# EAGLE schematic LinearPSURevDV4 (EAGLE 8.2.2)
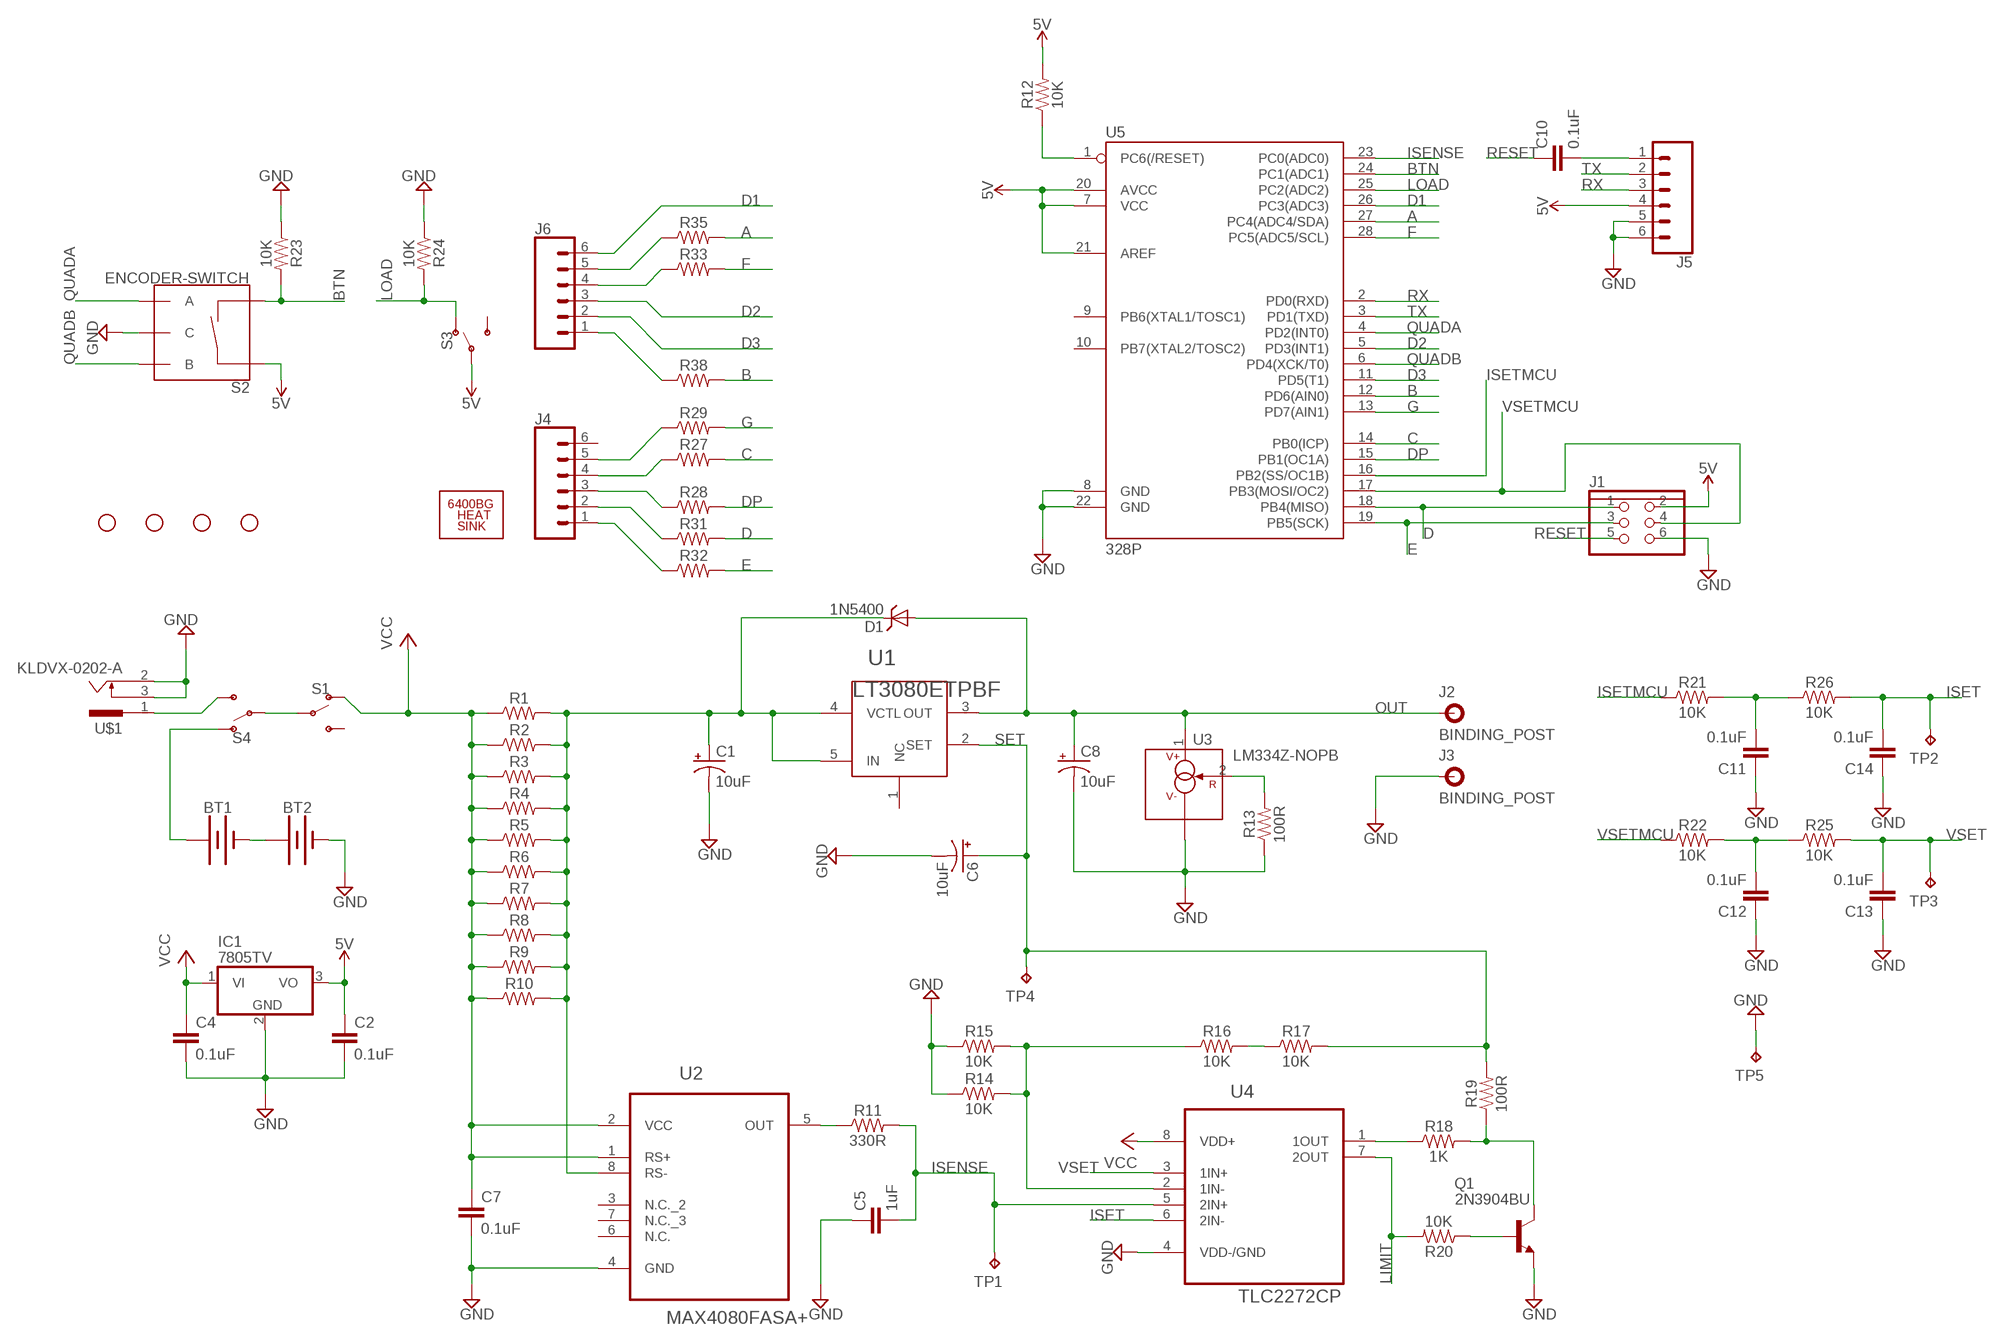
[diagram p0: schematic, sheet 1]

## Parts
BT1  BATTERY-9V  [BATTCON_9V]
BT2  BATTERY-9V  [BATTCON_9V]
C1  10uF  10UF-POLAR-RADIAL-2.5MM-25V-20%  [CPOL-RADIAL-2.5MM-5MM]
C2  0.1uF  22PF-PTH-2.54MM-200V-5%  [CAP-PTH-2.54]
C4  0.1uF  22PF-PTH-2.54MM-200V-5%  [CAP-PTH-2.54]
C5  1uF  22PF-PTH-2.54MM-200V-5%  [CAP-PTH-2.54]
C6  10uF  10UF-POLAR-RADIAL-2.5MM-25V-20%  [CPOL-RADIAL-2.5MM-5MM]
C7  0.1uF  22PF-PTH-2.54MM-200V-5%  [CAP-PTH-2.54]
C8  10uF  10UF-POLAR-RADIAL-2.5MM-25V-20%  [CPOL-RADIAL-2.5MM-5MM]
C10  0.1uF  22PF-PTH-2.54MM-200V-5%  [CAP-PTH-2.54]
C11  0.1uF  22PF-PTH-2.54MM-200V-5%  [CAP-PTH-2.54]
C12  0.1uF  22PF-PTH-2.54MM-200V-5%  [CAP-PTH-2.54]
C13  0.1uF  22PF-PTH-2.54MM-200V-5%  [CAP-PTH-2.54]
C14  0.1uF  22PF-PTH-2.54MM-200V-5%  [CAP-PTH-2.54]
D1  1N5400  [DO201-15]
H1  STAND-OFF  [STAND-OFF]
H2  STAND-OFF  [STAND-OFF]
H3  STAND-OFF  [STAND-OFF]
H4  STAND-OFF  [STAND-OFF]
H5  6400BG_HEATSINK  [6400BG_HEATSINK]
IC1  7805TV  [TO220V]
J1  PINHD2X03  [PINHD2X03]
J2  BINDING_POST  [BINDING_POST]
J3  BINDING_POST  [BINDING_POST]
J4  CONN_06NO_SILK_FEMALE_PTH  [1X06_NO_SILK]
J5  CONN_06NO_SILK_FEMALE_PTH  [1X06_NO_SILK]
J6  CONN_06NO_SILK_FEMALE_PTH  [1X06_NO_SILK]
Q1  2N3904BU  [TO92]
R1  2R  0OHM-0603-1/10W-5%  [0603]
R2  2R  0OHM-0603-1/10W-5%  [0603]
R3  2R  0OHM-0603-1/10W-5%  [0603]
R4  2R  0OHM-0603-1/10W-5%  [0603]
R5  2R  0OHM-0603-1/10W-5%  [0603]
R6  2R  0OHM-0603-1/10W-5%  [0603]
R7  2R  0OHM-0603-1/10W-5%  [0603]
R8  2R  0OHM-0603-1/10W-5%  [0603]
R9  2R  0OHM-0603-1/10W-5%  [0603]
R10  2R  0OHM-0603-1/10W-5%  [0603]
R11  330R  1KOHM-HORIZ-1/4W-1%  [AXIAL-0.3]
R12  10K  1KOHM-HORIZ-1/4W-1%  [AXIAL-0.3]
R13  100R  1KOHM-HORIZ-1/4W-1%  [AXIAL-0.3]
R14  10K  1KOHM-HORIZ-1/4W-1%  [AXIAL-0.3]
R15  10K  1KOHM-HORIZ-1/4W-1%  [AXIAL-0.3]
R16  10K  1KOHM-HORIZ-1/4W-1%  [AXIAL-0.3]
R17  10K  1KOHM-HORIZ-1/4W-1%  [AXIAL-0.3]
R18  1K  1KOHM-HORIZ-1/4W-1%  [AXIAL-0.3]
R19  100R  1KOHM-HORIZ-1/4W-1%  [AXIAL-0.3]
R20  10K  1KOHM-HORIZ-1/4W-1%  [AXIAL-0.3]
R21  10K  1KOHM-HORIZ-1/4W-1%  [AXIAL-0.3]
R22  10K  1KOHM-HORIZ-1/4W-1%  [AXIAL-0.3]
R23  10K  1KOHM-HORIZ-1/4W-1%  [AXIAL-0.3]
R24  10K  1KOHM-HORIZ-1/4W-1%  [AXIAL-0.3]
R25  10K  1KOHM-HORIZ-1/4W-1%  [AXIAL-0.3]
R26  10K  1KOHM-HORIZ-1/4W-1%  [AXIAL-0.3]
R27  10K  1KOHM-HORIZ-1/4W-1%  [AXIAL-0.3]
R28  10K  1KOHM-HORIZ-1/4W-1%  [AXIAL-0.3]
R29  10K  1KOHM-HORIZ-1/4W-1%  [AXIAL-0.3]
R31  10K  1KOHM-HORIZ-1/4W-1%  [AXIAL-0.3]
R32  10K  1KOHM-HORIZ-1/4W-1%  [AXIAL-0.3]
R33  10K  1KOHM-HORIZ-1/4W-1%  [AXIAL-0.3]
R35  10K  1KOHM-HORIZ-1/4W-1%  [AXIAL-0.3]
R38  10K  1KOHM-HORIZ-1/4W-1%  [AXIAL-0.3]
S1  SWITCH-SPDT-PTH-11.6X4.0MM-LOCK  [SWITCH_SPDT_PTH_11.6X4.0MM_LOCK]
S2  ENCODER-SWITCH  [ROTARY_ENC_PLAIN]
S3  SWITCH-SPDT-PTH-11.6X4.0MM-LOCK  [SWITCH_SPDT_PTH_11.6X4.0MM_LOCK]
S4  SWITCH-SPDT-PTH-11.6X4.0MM-LOCK  [SWITCH_SPDT_PTH_11.6X4.0MM_LOCK]
TP1  TPTP14SQ  [TP14SQ]
TP2  TPTP14SQ  [TP14SQ]
TP3  TPTP14SQ  [TP14SQ]
TP4  TPTP14SQ  [TP14SQ]
TP5  TPTP14SQ  [TP14SQ]
U1  LT3080ETPBF  [TO220-51]
U2  MAX4080FASA+  [SOIC127P600X175-8N]
U3  LM334Z-NOPB  [TO92]
U4  TLC2272CP  [DIP254P762X508-8]
U5  328P  ATMEGA328P_PDIP  [DIP28]
U$1  KLDVX-0202-A  [KLDVX-0202-A]

## Nets
5V: C2.1 IC1.3(VO) J1.2 J5.4 R12.P$2 S2.SW+ S3.2(P) U5.7(VCC) U5.20(AVCC) U5.21(AREF)
A: R35.P$2 U5.27(PC4(ADC4/SDA))
B: R38.P$2 U5.12(PD6(AIN0))
BTN: R23.P$2 S2.SW- U5.24(PC1(ADC1))
C: R27.P$2 U5.14(PB0(ICP))
D: J1.1 R31.P$2 U5.18(PB4(MISO))
D1: J6.6 U5.26(PC3(ADC3))
D2: J6.3 U5.5(PD3(INT1))
D3: J6.2 U5.11(PD5(T1))
DP: R28.P$2 U5.15(PB1(OC1A))
E: J1.3 R32.P$2 U5.19(PB5(SCK))
F: R33.P$2 U5.28(PC5(ADC5/SCL))
G: R29.P$2 U5.13(PD7(AIN1))
GND: BT2.- C1.2(-) C2.2 C4.2 C5.1 C6.2(-) C7.2 C8.2(-) C11.1 C12.1 C13.1 C14.1 IC1.2(GND) J1.6 J3.P$1 J5.5 J5.6 Q1.3(E) R13.P$1 R14.P$1 R15.P$1 R23.P$1 R24.P$1 S2.C TP5.TP U2.4(GND) U3.3(V-) U4.4(VDD-/GND) U5.8(GND) U5.22(GND) U$1.2 U$1.3
ISENSE: C5.2 R11.P$2 TP1.TP U4.5(2IN+) U5.23(PC0(ADC0))
ISET: C14.2 R26.P$2 TP2.TP U4.6(2IN-)
ISETMCU: R21.P$1 U5.16(PB2(SS/OC1B))
LIMIT: R20.P$2 U4.7(2OUT)
LOAD: R24.P$2 S3.1(O) U5.25(PC2(ADC2))
N$1: S4.3(S) U$1.1
N$2: C10.2 J5.1
N$4: C1.1(+) D1.C R1.2 R2.2 R3.2 R4.2 R5.2 R6.2 R7.2 R8.2 R9.2 R10.2 U1.4(VCTL) U1.5(IN) U2.8(RS-)
N$5: R11.P$1 U2.5(OUT)
N$6: R18.P$1 U4.1(1OUT)
N$7: R13.P$2 U3.2(R)
N$8: Q1.1(C) R18.P$2 R19.P$1
N$9: Q1.2(B) R20.P$1
N$10: R16.P$2 R17.P$1
N$11: R14.P$2 R15.P$2 R16.P$1 U4.2(1IN-)
N$13: BT1.- BT2.+
N$14: S1.2(P) S4.2(P)
N$15: BT1.+ S4.1(O)
N$17: J4.5 R29.P$1
N$18: J4.4 R27.P$1
N$19: J4.3 R28.P$1
N$20: C11.2 R21.P$2 R26.P$1
N$21: C12.2 R22.P$2 R25.P$1
N$22: J4.2 R31.P$1
N$23: J4.1 R32.P$1
N$31: J6.5 R35.P$1
N$32: J6.4 R33.P$1
N$35: J6.1 R38.P$1
OUT: C8.1(+) D1.A J2.P$1 U1.3(OUT) U3.1(V+)
QUADA: S2.A U5.4(PD2(INT0))
QUADB: S2.B U5.6(PD4(XCK/T0))
RESET: C10.1 J1.5 R12.P$1 U5.1(PC6(/RESET))
RX: J5.3 U5.2(PD0(RXD))
SET: C6.1(+) R17.P$2 R19.P$2 TP4.TP U1.2(SET)
TX: J5.2 U5.3(PD1(TXD))
VCC: C4.1 C7.1 IC1.1(VI) R1.1 R2.1 R3.1 R4.1 R5.1 R6.1 R7.1 R8.1 R9.1 R10.1 S1.1(O) U2.1(RS+) U2.2(VCC) U4.8(VDD+)
VSET: C13.2 R25.P$2 TP3.TP U4.3(1IN+)
VSETMCU: J1.4 R22.P$1 U5.17(PB3(MOSI/OC2))
Unconnected: J4.6 S1.3(S) S3.3(S) U1.1(NC) U2.3(N.C._2) U2.6(N.C.) U2.7(N.C._3) U5.9(PB6(XTAL1/TOSC1)) U5.10(PB7(XTAL2/TOSC2)) U$1.1@1 U$1.2@1 U$1.3@1

## Library data of the parts
BT1 BT2 = SparkFun-Batteries:BATTERY: Battery - Single Cell A variety of battery chemistries, sizes, and footprints. Device List: 20MM_PTH - Coin Cell Battery Holder - 20mm (PTH) <https://www.sparkfun.com/products/783> 12MM_SMD - Coin Cell Battery Holder - 12mm (SMD) <https://www.sparkfun.com/products/10592> 12MM_PTH - Coin Cell Battery Holder - 12mm (PTH) <https://www.sparkfun.com/products/7948> 20MM_SMD - 20mm Coin Cell Battery Holder (SMD) (2 legs) Used on the Big Time Watch Kit <https://www.sparkfun.com/products/11734> 20MM_SMD_4LEGS - Coin Cell Battery Holder - 20mm (SMD) <https://www.sparkfun.com/products/11892> 20MM_SMD_4LEGS_OVERPASTE - Coin Cell Battery Holder - 20mm (SMD) <https://www.sparkfun.com/products/11892> (Over-paste on the legs) 24.5MM_PTH - Coin Cell Battery Holder - 24.5mm (PTH) <https://www.sparkfun.com/products/8863> 9V - 9V Battery Holder - PC Mount Used on the SparkFun SparkPunk Sound Kit <https://www.sparkfun.com/products/11177> and SparkFun SparkPunk Sequencer Kit <https://www.sparkfun.com/products/12707> 18650 - Battery Holder - 18650 (PTH) <https://www.sparkfun.com/products/13113> AA - Battery Holder - 1xAA (PTH) <https://www.sparkfun.com/products/7949> AAA - Battery Holder - 1xAAA (PTH) <https://www.sparkfun.com/products/12718> AA_KIT - Battery Holder - 1xAA (PTH) <https://www.sparkfun.com/products/7949> Special kit package - pads only have exposed copper on one side of the board. AAA_KIT - Battery Holder - 1xAAA (PTH) <https://www.sparkfun.com/products/12718> Special kit package - pads only have exposed copper on one side of the board.; PROD_ID: BATT-10855
C1 C6 C8 = SparkFun-Capacitors:10UF-POLAR: 10.0µF polarized capacitors A capacitor is a passive two-terminal electrical component used to store electrical energy temporarily in an electric field.; PROD_ID: CAP-08440
C2 C4 C5 C7 C10-C14 = SparkFun-Capacitors:22PF: 22pF ceramic capacitors A capacitor is a passive two-terminal electrical component used to store electrical energy temporarily in an electric field.; PROD_ID: CAP-09128; VALUE: 22pF
D1 = Bifrost_parts:1N5400: DIODE standard rectifier, 50V, 3A; DESCRIPTION: Diode, 50V, 3A, Rectifier; MPN: 1N5400G; OC_FARNELL: 1458988; OC_NEWARK: 42K2929; PACKAGE: DO-201AD; SUPPLIER: ON Semiconductors
H1-H4 = SparkFun-Hardware:STAND-OFF: Stand Off Drill holes for mechanically mounting via screws, standoffs, etc. Note: Use the keepout ring to avoid running the screw head into surrounding components. Variant Overviews STAND-OFF - Mechanical footprint for a #4 phillips button head screw. STAND-OFF-TIGHT - Mechanical footprint for a #4 phillips button head screw, Example SparkFun Products Screw - Phillips Head (1/4", 4-40, 10 pack) <https://www.sparkfun.com/products/10453> (PRT-10453) Screw - Phillips Head (1/2", 4-40, 10 pack) <https://www.sparkfun.com/products/10452> (PRT-10452) Screw - Phillips Head (3/4", 4-40, 10 pack) <https://www.sparkfun.com/products/10451> (PRT-10451) Screw - Phillips Head (1", 4-40, 10 pack) <https://www.sparkfun.com/products/10450> (PRT-10450)
H5 = SparkFun-Hardware:6400BG_HEATSINK: 6400BG Heatsink - Multiwatt Package This beefy heatsink is designed to dissipate a lot of heat! The 6400BG heatsink fits TO-220, TO-218, TO-247, and Multiwatt packages - which means it’s a great fit for the STA540 <http://www.sparkfun.com/commerce/product_info.php?products_id=9557>, L298N <http://www.sparkfun.com/commerce/product_info.php?products_id=9479>, and all of our T-220 package voltage regulators <http://www.sparkfun.com/commerce/advanced_search_result.php?keywords=TO-220+COM&x=21&y=16&search_section=products>. SparkFun Products Heat Sink - Multiwatt Package <https://www.sparkfun.com/products/9576> (PRT-09576); PROD_ID: COMP-09537; SF_SKU: PRT-09576
IC1 = linear:78*: Positive VOLTAGE REGULATOR Source: http://cache.national.com/ds/LM/LM78L05.pdf http://www.fairchildsemi.com/ds/LM/LM7805.pdf
J1 = Bifrost_parts:PINHD2X03: PIN HEADER, 2X03
J2 J3 = SparkFun-Connectors:BINDING_POST: Binding Post The component itself has an threaded, insulated body that goes through the board, with a small threaded metal stud coming off the back. The intent of this package is that the post goes through a milled obling hole, and a small wire would be used to connect from the PCB pad to the metal contact on the post. SparkFun Products: SparkFun Decade Resistance Box <https://www.sparkfun.com/products/13006> SparkFun Benchtop Power Board Kit <https://www.sparkfun.com/products/12867> Binding Post - Red <https://www.sparkfun.com/products/9739> Binding Post - Black <https://www.sparkfun.com/products/9740>; PROD_ID: CONN-09675; SF_ID: PRT-09740
J4-J6 = SparkFun-Connectors:CONN_06: Multi connection point. Often used as Generic Header-pin footprint for 0.1 inch spaced/style header connections On any of the 0.1 inch spaced packages, you can populate with these: Break Away Headers - Straight <https://www.sparkfun.com/products/116> (PRT-00116) Break Away Male Headers - Right Angle <https://www.sparkfun.com/products/553> (PRT-00553) Female Headers <https://www.sparkfun.com/products/115> (PRT-00115) Break Away Headers - Machine Pin <https://www.sparkfun.com/products/117> (PRT-00117) Break Away Female Headers - Swiss Machine Pin <https://www.sparkfun.com/products/743> (PRT-00743) Arduino Stackable Header - 6 Pin <https://www.sparkfun.com/products/9280> (PRT-09280) For SCREWTERMINALS and SPRING TERMINALS visit here: Screw Terimnals on SparkFun.com <https://www.sparkfun.com/search/results?term=Screw+Terminals> (5mm/3.5mm/2.54mm spacing) This device is also useful as a general connection point to wire up your design to another part of your project. Our various solder wires solder well into these plated through hole pads. Hook-Up Wire - Assortment (Stranded, 22 AWG) <https://www.sparkfun.com/products/11375> (PRT-11375) Hook-Up Wire - Assortment (Solid Core, 22 AWG) <https://www.sparkfun.com/products/11367> (PRT-11367) View the entire wire category on our website here <https://www.sparkfun.com/categories/141>; PROD_ID: CONN-08437
Q1 = Bifrost_parts:2N3904: NPN Transistor; DESCRIPTION: Transistor, NPN; MPN: 2N3904BU; OC_FARNELL: 1700648; OC_NEWARK: 83C3116; PACKAGE: TO-92; SUPPLIER: Fairchild Semiconductors
R1-R10 = SparkFun-Resistors:0OHM: 0Ω resistor A resistor is a passive two-terminal electrical component that implements electrical resistance as a circuit element. Resistors act to reduce current flow, and, at the same time, act to lower voltage levels within circuits. - Wikipedia; PROD_ID: RES-08609; VALUE: 0
R11-R29 R31-R33 R35 R38 = SparkFun-Resistors:1KOHM: 1kΩ resistor A resistor is a passive two-terminal electrical component that implements electrical resistance as a circuit element. Resistors act to reduce current flow, and, at the same time, act to lower voltage levels within circuits. - Wikipedia; PROD_ID: RES-12182; VALUE: 1k
S1 S3 S4 = SparkFun-Switches:SWITCH-SPDT: Single Pole, Double Throw (SPDT) Switch Single-pole, double-throw (SPDT) switch. Variant Overview SMD-AYZ0202 Surface Mount DPDT Switch <https://www.sparkfun.com/products/597> (COM-00597) Used on e.g. LilyPad Arduino USB - ATmega32U4 Board <https://www.sparkfun.com/products/12049> PTH-11.6X4.0MM SPDT Mini Power Switch <https://www.sparkfun.com/products/102> (COM-00102) Used on e.g. SparkFun Simon Says - Through-Hole Soldering Kit <https://www.sparkfun.com/products/10547> (KIT-10547) PTH-11.6X4.0MM-KIT KIT version of SPDT Mini Power Switch - Simplifies soldering by removing tStop of switch pins - only one side can be soldered. PTH-11.6X4.0MM-LOCK LOCK version of SPDT Mini Power Switch - Offset pins hold switch in place for easier soldering. SMD-RIGHT-ANGLE Surface Mount Right Angle Switch <https://www.sparkfun.com/products/10860> (COM-10860) Used on e.g. SparkFun ESP8266 Thing <https://www.sparkfun.com/products/13231>; PROD_ID: SWCH-08261; SF_SKU: COM-00102
S2 = SparkFun-Switches:ENCODER-SWITCH: Rotary Encoder w/ Select Switch Encoders rotate similarly to potentiometers, but they’re different from potentiometers in that an encoder has full rotation without limits. They output gray code so that you can tell how much and in which direction the encoder has been turned. This encoder includes a push-down select switch built into the shaft. SparkFun Products Rotary Encoder <https://www.sparkfun.com/products/9117> (COM-09117); SF_SKU: COM-09117
TP1-TP5 = testpad:TP: Test pad
U1 = Bifrost_parts:LT3080: Adjustable1.1A Single Resistor Low Dropout Regulator; DESCRIPTION: Adjustable1.1A Single Resistor Low Dropout Regulator; MPN: LT3080ET#PBF; OC_FARNELL: 1537445; OC_NEWARK: 64M0567; PACKAGE: TO220-51; SUPPLIER: Linear Technologies
U2 = Bifrost_parts:MAX4080; DESCRIPTION: 76V, High-Side, Current-Sense Amplifiers with Voltage Output; MPN: MAX4080FASA+; OC_FARNELL: -; OC_NEWARK: 43K3468; PACKAGE: SOIC-8; SUPPLIER: Maxim
U3 = Bifrost_parts:LM334: 3-Terminal Adjustable Current Source; DESCRIPTION: 3-Terminal Adjustable Current Source; MPN: LM334Z-NOPB; OC_FARNELL: 1564650; OC_NEWARK: 41K4701; PACKAGE: TO-92; SUPPLIER: Texas Instruments
U4 = Texas Instruments_By_element14_Batch_1:TLC2272CP: OPERATIONAL AMPLIFIER; MPN: TLC2272CP; OC_FARNELL: 8454051; OC_NEWARK: 35K1183; PACKAGE: PDIP; SUPPLIER: Texas Instruments
U5 = SparkFun-IC-Microcontroller:ATMEGA328P_PDIP: Atmel 328P Through hole ATMEGA328P uC used in the Arduino 32kb flash, 1k EEPROM, 2k SRAM Datasheet <http://www.sparkfun.com/datasheets/Components/SMD/ATMega328.pdf> SparkFun Products Storefront component: AVR 28 Pin 20MHz 32K 6A/D - ATMega328P <https://www.sparkfun.com/products/9061> (COM-09061) SparkFun Simon Says - Through-Hole Soldering Kit <https://www.sparkfun.com/products/10547> (KIT-10547) SparkFun Learn to Solder - Simon Says <https://www.sparkfun.com/products/13708> (KIT-13708) SparkFun BigTime Watch Kit <https://www.sparkfun.com/products/11734> (KIT-11734) SparkFun ClockIt <https://www.sparkfun.com/products/10930> (KIT-10930) SparkFun Serial Enabled LCD Kit <https://www.sparkfun.com/products/10097> (LCD-10097) SparkFun Simon Tilts - Through Hole Soldering Kit <https://www.sparkfun.com/products/12634> (KIT-12634) SparkFun Frequency Counter Kit <https://www.sparkfun.com/products/10140> (KIT-10140) FabFM Radio Kit <https://www.sparkfun.com/products/11043> (KIT-11043) SparkFun Binary Blaster Kit <https://www.sparkfun.com/products/12037> (KIT-12037) SparkFun Metro-Gnome <https://www.sparkfun.com/products/9236> (KIT-09236) ATmega328 with Arduino Optiboot (Uno) <https://www.sparkfun.com/products/10524> (DEV-10524); PROD_ID: IC-09136
U$1 = con-kycon:KLDVX-0202-: Power Jack, Vertical, PCB Mount, 2.0 mm, 2.5 mm, 3.0 mm Center Pin Source: KLDVX-0202x.pdf; OC_FARNELL: unknown; OC_NEWARK: unknown